# EAGLE schematic picodev (EAGLE 9.6.2)
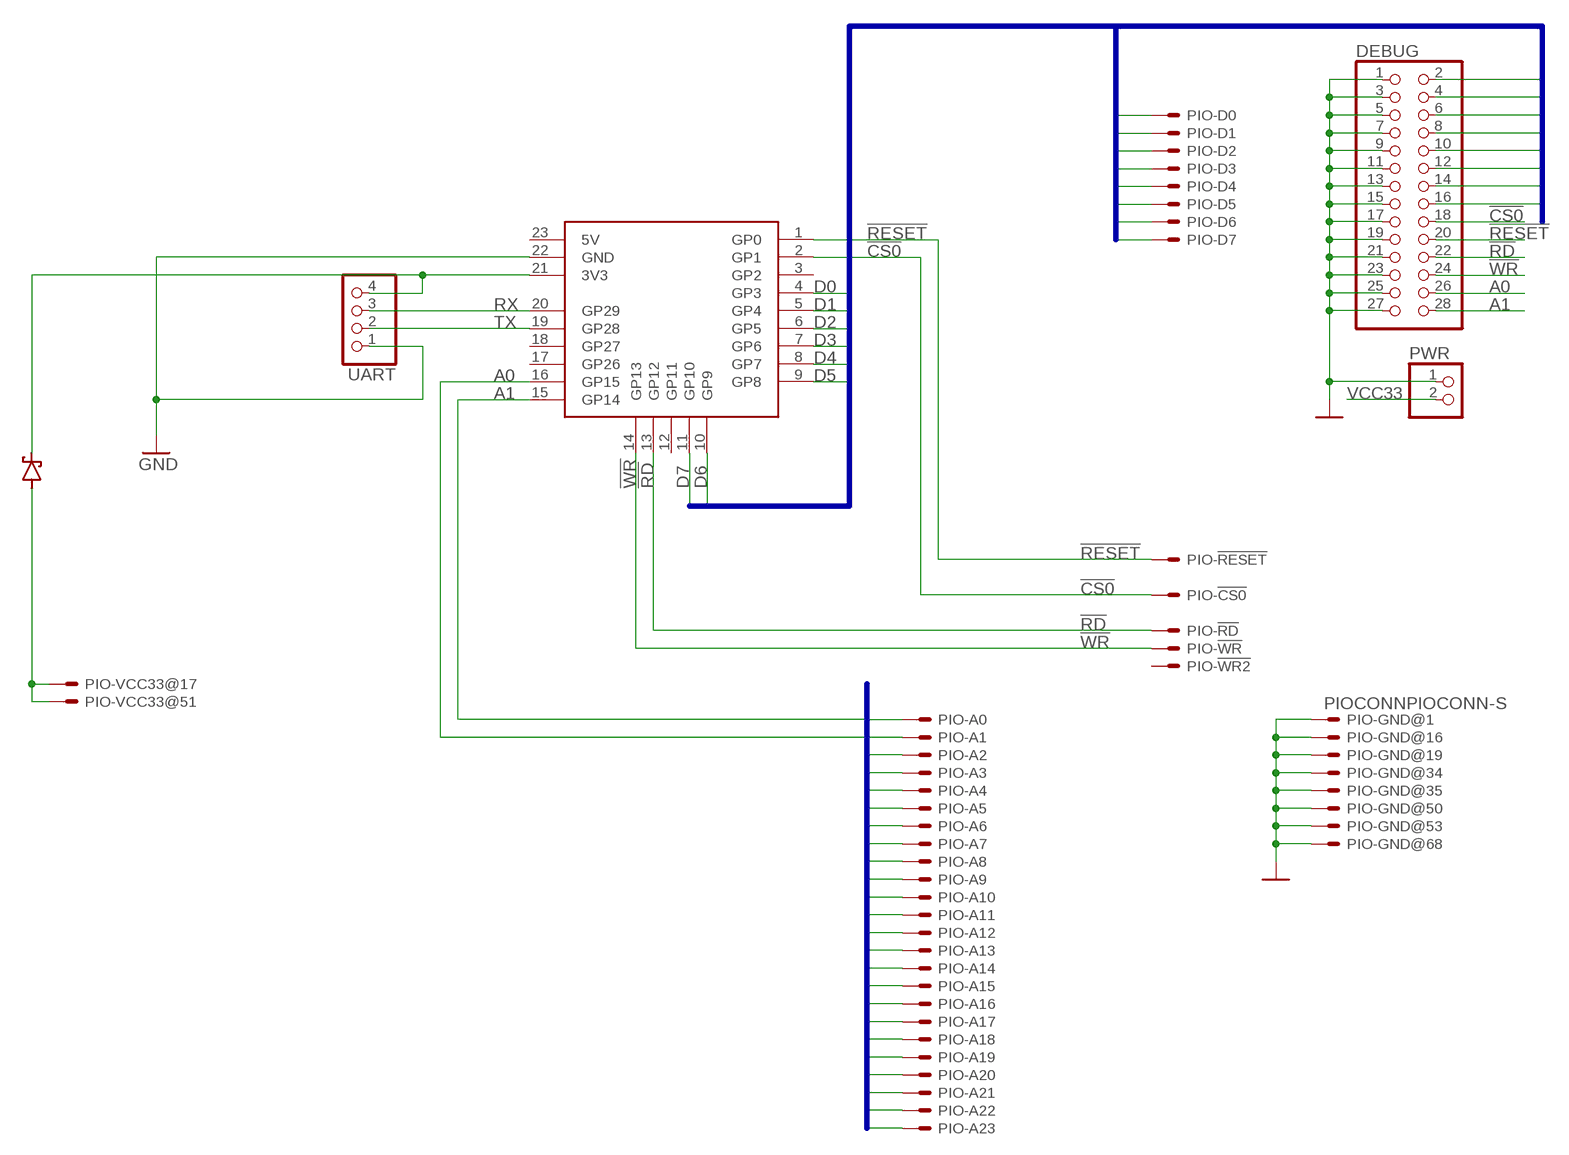
[diagram p0: schematic, sheet 1, part 1 of 2]
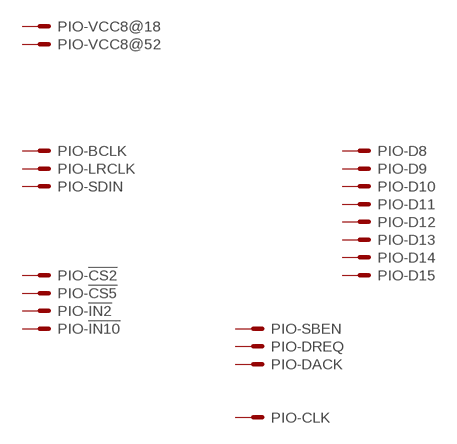
[diagram p1: schematic, sheet 1, part 2 of 2]

## Parts
D  SCHOTTKYSMA  [SMADIODE]
DEBUG  PINHD-2X14  [2X14]
PIO  PIOCONNPIOCONN-S  [PIOCONN]
PWR  PINHD-1X2  [1X02]
U$1  PICO-ZERO  [PICO-ZERO]
UART  PINHD-1X4  [1X04]

## Nets
!CS0: DEBUG.18 PIO.4 U$1.2(GP1)
!RD: DEBUG.22 PIO.30 U$1.13(GP12)
!RESET: DEBUG.20 PIO.2 U$1.1(GP0)
!WR: DEBUG.24 PIO.64 U$1.14(GP13)
A0: DEBUG.26 PIO.14 U$1.16(GP15)
A1: DEBUG.28 PIO.48 U$1.15(GP14)
A2: PIO.15
A3: PIO.49
A4: PIO.20
A5: PIO.54
A6: PIO.21
A7: PIO.55
A8: PIO.22
A9: PIO.56
A10: PIO.23
A11: PIO.57
A12: PIO.24
A13: PIO.58
A14: PIO.25
A15: PIO.59
A16: PIO.26
A17: PIO.60
A18: PIO.27
A19: PIO.61
A20: PIO.28
A21: PIO.62
A22: PIO.29
A23: PIO.63
D0: DEBUG.16 PIO.6 U$1.4(GP3)
D1: DEBUG.14 PIO.40 U$1.5(GP4)
D2: DEBUG.12 PIO.7 U$1.6(GP5)
D3: DEBUG.10 PIO.41 U$1.7(GP6)
D4: DEBUG.8 PIO.8 U$1.8(GP7)
D5: DEBUG.6 PIO.42 U$1.9(GP8)
D6: DEBUG.4 PIO.9 U$1.10(GP9)
D7: DEBUG.2 PIO.43 U$1.11(GP10)
GND: DEBUG.1 DEBUG.3 DEBUG.5 DEBUG.7 DEBUG.9 DEBUG.11 DEBUG.13 DEBUG.15 DEBUG.17 DEBUG.19 DEBUG.21 DEBUG.23 DEBUG.25 DEBUG.27 PIO.1 PIO.16 PIO.19 PIO.34 PIO.35 PIO.50 PIO.53 PIO.68 PWR.1 U$1.22(GND) UART.1
PIOVCC33: D.A PIO.17 PIO.51
RX: U$1.20(GP29) UART.3
TX: U$1.19(GP28) UART.2
VCC33: D.C PWR.2 U$1.21(3V3) UART.4
Unconnected: PIO.3 PIO.5 PIO.10 PIO.11 PIO.12 PIO.13 PIO.18 PIO.31 PIO.32 PIO.33 PIO.36 PIO.37 PIO.38 PIO.39 PIO.44 PIO.45 PIO.46 PIO.47 PIO.52 PIO.65 PIO.66 PIO.67 U$1.3(GP2) U$1.12(GP11) U$1.17(GP26) U$1.18(GP27) U$1.23(5V)

## Buses
A[0..23]
D[0..7]

## Library data of the parts
D = pixel:SCHOTTKY
DEBUG = pinhead:PINHD-2X14: PIN HEADER
PIO = pixel:PIOCONN: CONNECTOR 68-pin 1.27mm (.050 inch) pitch SCSI+ unshielded receptacle right angle all plastic
PWR = pinhead:PINHD-1X2: PIN HEADER
U$1 = pixel:PICO-ZERO
UART = pinhead:PINHD-1X4: PIN HEADER